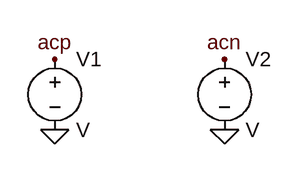
[diagram p0: schematic dc_detect.asc]
dc_detect.asc, the LTspice schematic file:
Version 4
SHEET 1 880 680
FLAG -32 208 0
FLAG -32 128 acp
FLAG 160 208 0
FLAG 160 128 acn
SYMBOL voltage -32 112 R0
SYMATTR InstName V1
SYMBOL voltage 160 112 R0
SYMATTR InstName V2

The netlist it stands for:
* dc_detect.asc
V1 acp 0 V
V2 acn 0 V
.backanno
.end